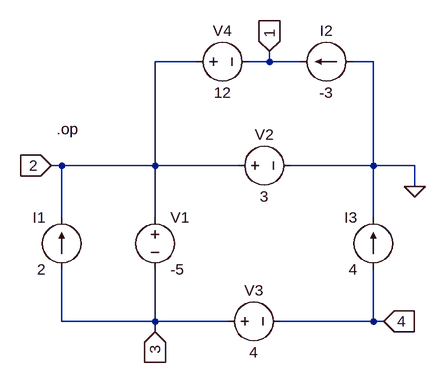
[diagram p0: schematic test_10.asc]
test_10.asc, the LTspice schematic file:
Version 4
SHEET 1 880 680
WIRE 16 -352 -48 -352
WIRE 128 -352 128 -368
WIRE 128 -352 96 -352
WIRE 176 -352 128 -352
WIRE 288 -352 256 -352
WIRE -192 -192 -208 -192
WIRE -48 -192 -48 -352
WIRE -48 -192 -192 -192
WIRE 80 -192 -48 -192
WIRE 288 -192 288 -352
WIRE 288 -192 160 -192
WIRE 352 -192 288 -192
WIRE 352 -160 352 -192
WIRE -192 -112 -192 -192
WIRE -48 -112 -48 -192
WIRE 288 -112 288 -192
WIRE -192 48 -192 -32
WIRE -48 48 -48 -32
WIRE -48 48 -192 48
WIRE 64 48 -48 48
WIRE 288 48 288 -32
WIRE 288 48 144 48
WIRE 304 48 288 48
WIRE -48 64 -48 48
FLAG 352 -160 0
FLAG -208 -192 2
IOPIN -208 -192 In
FLAG -48 64 3
IOPIN -48 64 In
FLAG 304 48 4
IOPIN 304 48 In
FLAG 128 -368 1
IOPIN 128 -368 In
SYMBOL current -192 -32 R180
WINDOW 0 24 80 Left 2
WINDOW 3 24 0 Left 2
WINDOW 123 0 0 Left 0
WINDOW 39 0 0 Left 0
SYMATTR InstName I1
SYMATTR Value 2
SYMBOL current 256 -352 R90
WINDOW 0 -32 40 VBottom 2
WINDOW 3 32 40 VTop 2
WINDOW 123 0 0 Left 0
WINDOW 39 0 0 Left 0
SYMATTR InstName I2
SYMATTR Value -3
SYMBOL current 288 -32 R180
WINDOW 0 24 80 Left 2
WINDOW 3 24 0 Left 2
WINDOW 123 0 0 Left 0
WINDOW 39 0 0 Left 0
SYMATTR InstName I3
SYMATTR Value 4
SYMBOL voltage -48 -128 R0
WINDOW 123 0 0 Left 0
WINDOW 39 0 0 Left 0
SYMATTR InstName V1
SYMATTR Value -5
SYMBOL voltage 64 -192 R270
WINDOW 0 32 56 VTop 2
WINDOW 3 -32 56 VBottom 2
WINDOW 123 0 0 Left 0
WINDOW 39 0 0 Left 0
SYMATTR InstName V2
SYMATTR Value 3
SYMBOL voltage 48 48 R270
WINDOW 0 32 56 VTop 2
WINDOW 3 -32 56 VBottom 2
WINDOW 123 0 0 Left 0
WINDOW 39 0 0 Left 0
SYMATTR InstName V3
SYMATTR Value 4
SYMBOL voltage 0 -352 R270
WINDOW 0 32 56 VTop 2
WINDOW 3 -32 56 VBottom 2
WINDOW 123 0 0 Left 0
WINDOW 39 0 0 Left 0
SYMATTR InstName V4
SYMATTR Value 12
TEXT -200 -248 Left 2 !.op

The netlist it stands for:
* test_10.asc
I1 3 2 2
I2 0 1 -3
I3 4 0 4
V1 2 3 -5
V2 2 0 3
V3 3 4 4
V4 2 1 12
.op
.backanno
.end